# EAGLE schematic usbtiny (EAGLE 6.4)
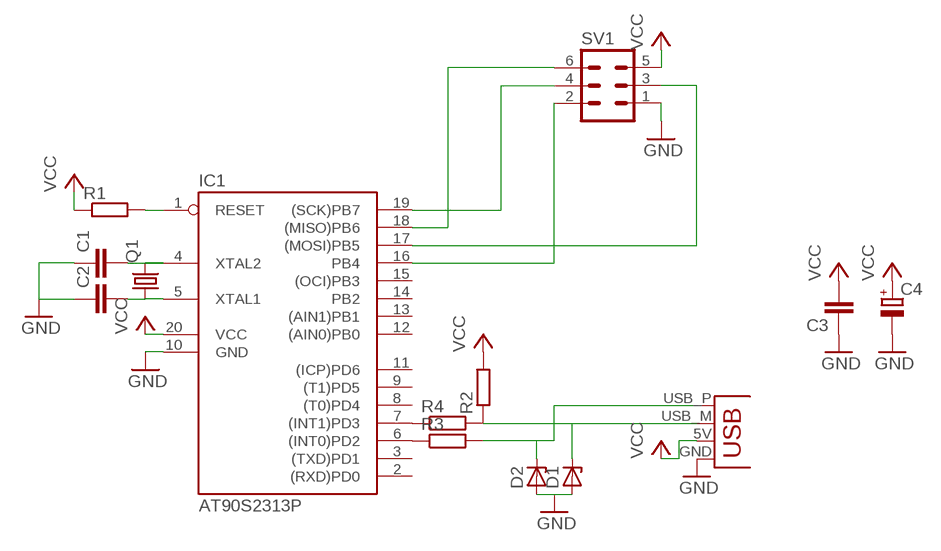
[diagram p0: schematic, sheet 1]

## Parts
C1  C-EU025-025X050  [C025-025X050]
C2  C-EU025-025X050  [C025-025X050]
C3  C-EU025-025X050  [C025-025X050]
C4  CPOL-EUE2.5-6  [E2,5-6]
D1  ZENER-DIODEDO35Z10  [DO35Z10]
D2  ZENER-DIODEDO35Z10  [DO35Z10]
IC1  AT90S2313P  [DIL20]
JP2  USBPCB  [USB-A-PCB]
Q1  CRYSTALHC49U70  [HC49U70]
R1  R-EU_0207/10  [0207/10]
R2  R-EU_0207/10  [0207/10]
R3  R-EU_0207/10  [0207/10]
R4  R-EU_0207/10  [0207/10]
SV1  MA03-2  [MA03-2]

## Nets
GND: C1.1 C2.1 C3.1 C4.- D1.A D2.A IC1.10(GND) JP2.GND SV1.1
N$1: C1.2 IC1.4(XTAL2) Q1.2
N$2: C2.2 IC1.5(XTAL1) Q1.1
N$3: IC1.1(RESET) R1.2
N$4: IC1.7((INT1)PD3) R4.1
N$5: IC1.6((INT0)PD2) R3.1
N$6: IC1.18((MISO)PB6) SV1.6
N$7: D2.C JP2.USB_P(D+) R3.2
N$8: IC1.19((SCK)PB7) SV1.4
N$10: IC1.17((MOSI)PB5) SV1.3
N$11: IC1.16(PB4) SV1.2
N$12: D1.C JP2.USB_M(D-) R2.1 R4.2
VCC: C3.2 C4.+ IC1.20(VCC) JP2.5V(VBUS) R1.1 R2.2 SV1.5
Unconnected: IC1.2((RXD)PD0) IC1.3((TXD)PD1) IC1.8((T0)PD4) IC1.9((T1)PD5) IC1.11((ICP)PD6) IC1.12((AIN0)PB0) IC1.13((AIN1)PB1) IC1.14(PB2) IC1.15((OCI)PB3)

## Library data of the parts
C1-C3 = rcl:C-EU: CAPACITOR, European symbol
C4 = rcl:CPOL-EU: POLARIZED CAPACITOR, European symbol
D1 D2 = diode:ZENER-DIODE: Z-Diode
IC1 = atmel:AT90S2313: MICROCONTROLLER 2 Kbytes FLASH 128 bytes SRAM 128 bytes EEPROM UART; OC_FARNELL: unknown; OC_NEWARK: unknown
JP2 = SparkFun-Connectors:USB: USB Connectors USB-B-PTH is fully proven SKU : PRT-00139/CONN-08278 USB-miniB is fully proven SKU : PRT-00587 USB-A-PCB is untested. USB-A-H is throughly reviewed, but untested. Spark Fun Electronics SKU : PRT-00437 USB-B-SMT is throughly reviewed, but untested. Needs silkscreen touching up. USB-A-S has not been used/tested USB-MB-H has not been used/tested USB-MICROB has been used. CONN-09505
Q1 = crystal:CRYSTAL: CRYSTAL; OC_FARNELL: unknown; OC_NEWARK: unknown
R1-R4 = resistor:R-EU_: RESISTOR, European symbol
SV1 = con-lstb:MA03-2: PIN HEADER; OC_FARNELL: unknown; OC_NEWARK: unknown